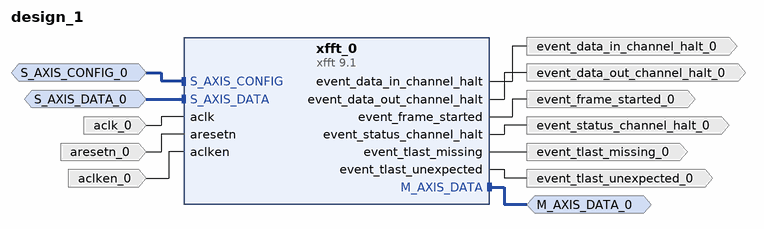
[diagram p0: block diagram of the top level]
# Vivado block design design_1, xc7z020clg484-1, Vivado 2020.2
create_bd_design design_1

create_bd_intf_port -mode Slave -vlnv xilinx.com:interface:axis_rtl:1.0 S_AXIS_DATA_0
set_property -dict [list \
  CONFIG.HAS_TKEEP 0 \
  CONFIG.HAS_TLAST 1 \
  CONFIG.HAS_TREADY 1 \
  CONFIG.HAS_TSTRB 0 \
  CONFIG.LAYERED_METADATA undef \
  CONFIG.TDATA_NUM_BYTES 12 \
  CONFIG.TDEST_WIDTH 0 \
  CONFIG.TID_WIDTH 0 \
  CONFIG.TUSER_WIDTH 0 \
] [get_bd_intf_ports S_AXIS_DATA_0]
create_bd_intf_port -mode Slave -vlnv xilinx.com:interface:axis_rtl:1.0 S_AXIS_CONFIG_0
set_property -dict [list \
  CONFIG.HAS_TKEEP 0 \
  CONFIG.HAS_TLAST 0 \
  CONFIG.HAS_TREADY 1 \
  CONFIG.HAS_TSTRB 0 \
  CONFIG.LAYERED_METADATA undef \
  CONFIG.TDATA_NUM_BYTES 3 \
  CONFIG.TDEST_WIDTH 0 \
  CONFIG.TID_WIDTH 0 \
  CONFIG.TUSER_WIDTH 0 \
] [get_bd_intf_ports S_AXIS_CONFIG_0]
create_bd_intf_port -mode Master -vlnv xilinx.com:interface:axis_rtl:1.0 M_AXIS_DATA_0
create_bd_port -dir O -type intr event_status_channel_halt_0
create_bd_port -dir I -type clk aclk_0
create_bd_port -dir O -type intr event_tlast_missing_0
create_bd_port -dir O -type intr event_tlast_unexpected_0
create_bd_port -dir O -type intr event_frame_started_0
create_bd_port -dir I -type rst aresetn_0
create_bd_port -dir O -type intr event_data_out_channel_halt_0
create_bd_port -dir I -type ce aclken_0
set_property -dict {CONFIG.POLARITY ACTIVE_HIGH} [get_bd_ports aclken_0]
create_bd_port -dir O -type intr event_data_in_channel_halt_0

create_bd_cell -type ip -vlnv xilinx.com:ip:xfft:9.1 xfft_0
set_property -dict [list \
  CONFIG.aclken true \
  CONFIG.aresetn true \
  CONFIG.channels 2 \
  CONFIG.implementation_options automatically_select \
  CONFIG.input_width 24 \
  CONFIG.number_of_stages_using_block_ram_for_data_and_phase_factors 0 \
  CONFIG.output_ordering natural_order \
  CONFIG.phase_factor_width 8 \
  CONFIG.run_time_configurable_transform_length false \
  CONFIG.target_clock_frequency 200 \
  CONFIG.target_data_throughput 1 \
  CONFIG.transform_length 32 \
  CONFIG.xk_index false \
] [get_bd_cells xfft_0]

# ---- connections ----

connect_bd_intf_net -intf_net S_AXIS_CONFIG_0_1 [get_bd_intf_ports S_AXIS_CONFIG_0] [get_bd_intf_pins xfft_0/S_AXIS_CONFIG]
connect_bd_intf_net -intf_net S_AXIS_DATA_0_1 [get_bd_intf_ports S_AXIS_DATA_0] [get_bd_intf_pins xfft_0/S_AXIS_DATA]
connect_bd_intf_net [get_bd_intf_ports M_AXIS_DATA_0] [get_bd_intf_pins xfft_0/M_AXIS_DATA]
connect_bd_net [get_bd_pins xfft_0/event_status_channel_halt] [get_bd_ports event_status_channel_halt_0]
connect_bd_net -net aclk_0_1 [get_bd_ports aclk_0] [get_bd_pins xfft_0/aclk]
connect_bd_net [get_bd_pins xfft_0/event_tlast_missing] [get_bd_ports event_tlast_missing_0]
connect_bd_net [get_bd_pins xfft_0/event_tlast_unexpected] [get_bd_ports event_tlast_unexpected_0]
connect_bd_net [get_bd_pins xfft_0/event_frame_started] [get_bd_ports event_frame_started_0]
connect_bd_net -net aresetn_0_1 [get_bd_ports aresetn_0] [get_bd_pins xfft_0/aresetn]
connect_bd_net [get_bd_pins xfft_0/event_data_out_channel_halt] [get_bd_ports event_data_out_channel_halt_0]
connect_bd_net -net aclken_0_1 [get_bd_ports aclken_0] [get_bd_pins xfft_0/aclken]
connect_bd_net [get_bd_pins xfft_0/event_data_in_channel_halt] [get_bd_ports event_data_in_channel_halt_0]

validate_bd_design
save_bd_design
